# EAGLE schematic specimen-sampler (EAGLE 8.6.3)
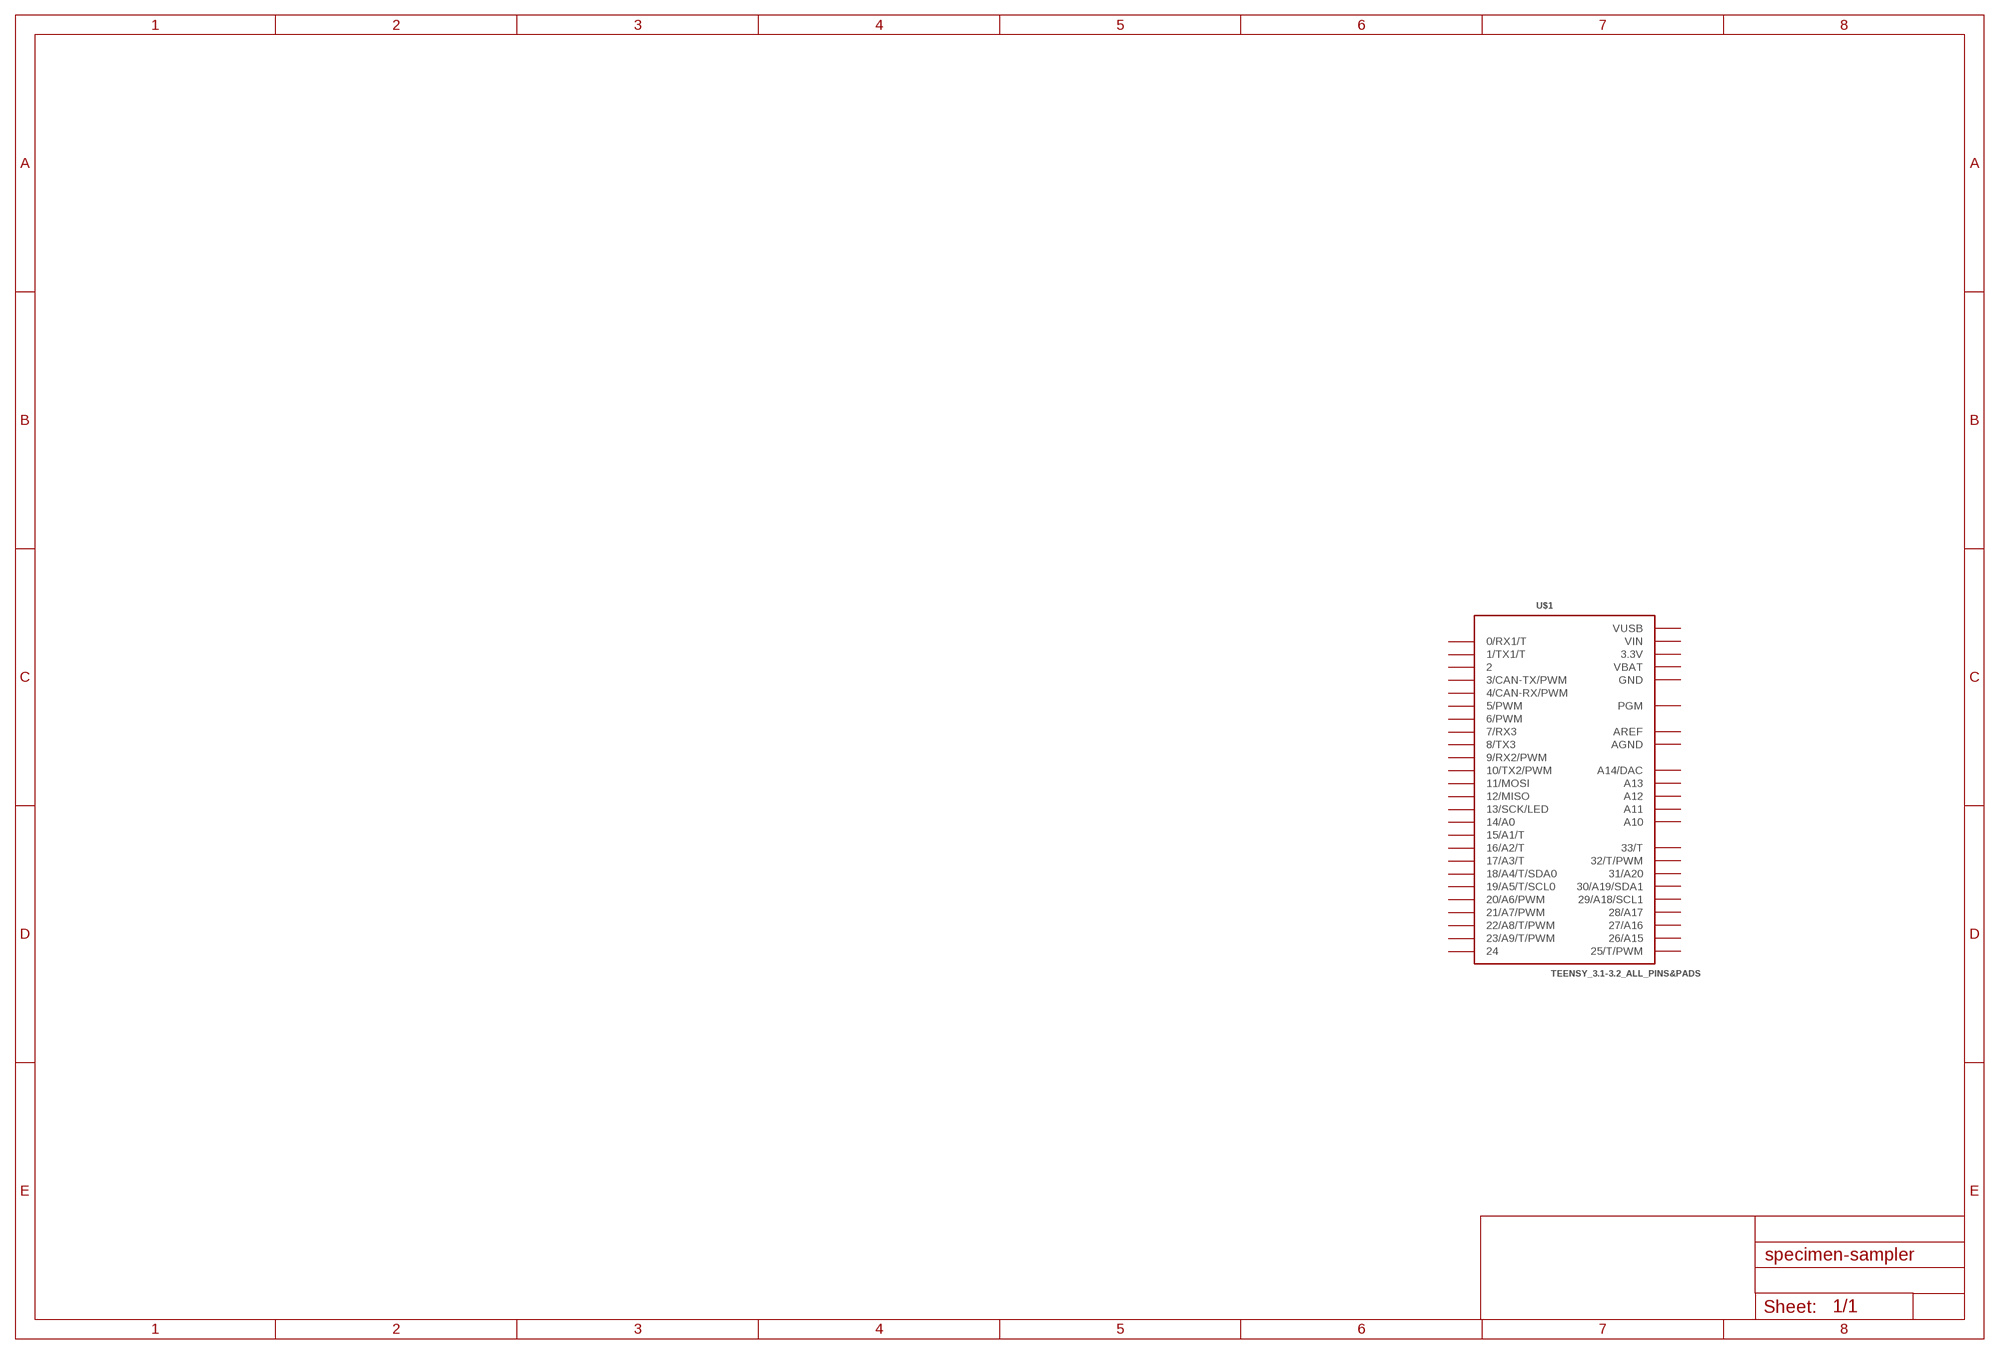
[diagram p0: schematic, sheet 1]

## Parts
U$1  TEENSY_3.1-3.2_ALL_PINS&PADS  [TEENSY_3.0-3.2_ALL_PINS_&_PADS]
Unconnected: U$1.0(0/RX1/T) U$1.1(1/TX1/T) U$1.2 U$1.3(3/CAN-TX/PWM) U$1.4(4/CAN-RX/PWM) U$1.5(5/PWM) U$1.6(6/PWM) U$1.7(7/RX3) U$1.8(8/TX3) U$1.9(9/RX2/PWM) U$1.10(10/TX2/PWM) U$1.11(11/MOSI) U$1.12(12/MISO) U$1.13(13/SCK/LED) U$1.14/A0 U$1.15/A1(15/A1/T) U$1.16/A2(16/A2/T) U$1.17/A3(17/A3/T) U$1.18/A4(18/A4/T/SDA0) U$1.19/A5(19/A5/T/SCL0) U$1.20/A6(20/A6/PWM) U$1.21/A7(21/A7/PWM) U$1.22/A8(22/A8/T/PWM) U$1.23/A9(23/A9/T/PWM) U$1.24 U$1.25(25/T/PWM) U$1.26(26/A15) U$1.27(27/A16) U$1.28(28/A17) U$1.29(29/A18/SCL1) U$1.30(30/A19/SDA1) U$1.31(31/A20) U$1.32(32/T/PWM) U$1.33(33/T) U$1.A10 U$1.A11 U$1.A12 U$1.A13 U$1.PGM U$1.RESET/DAC(A14/DAC)

## Power pins joined to a net without a drawn wire
3.3V: U$1.3.3V U$1.3.3V1(3.3V) U$1.3.3V2(3.3V)
AGND: U$1.AGND
AREF: U$1.AREF
GND: U$1.GND U$1.GND1(GND) U$1.GND2(GND)
VBAT: U$1.VBAT
VIN: U$1.VIN
VUSB: U$1.VUSB

## Library data of the parts
U$1 = Teensy_3_and_LC_Series_Boards_v1.4:TEENSY_3.1-3.2_ALL_PINS&PADS: Footprint for Teensy 3.1 or 3.2 board using all pads and all through-holes. Pads need a 2x7 0.1" SMD header.